# Altium schematic sheet VOLTAGE_RESOURCE.SchDoc: VOLTAGE_RESOURCE
size A4; Organization: My Company; Address1: Address Line 1; Address2: Address Line 2; Address3: Address Line 3; Address4: Address Line 4; SheetNumber: 2; SheetTotal: 4; ProjectTitle: Module_Ethernet_W5500
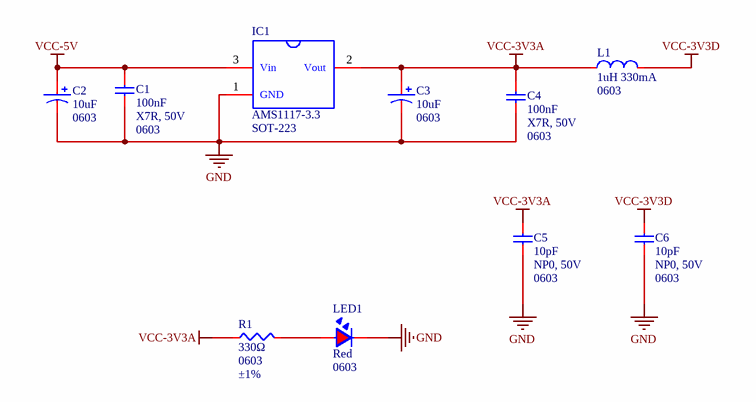
[diagram p0: VOLTAGE_RESOURCE.SchDoc]

## Parts
C1  100nF  Temperature Coefficient: X7R, 50V  Package: 0603  [C0603]
C2  10uF  Package: 0603  [C0603 - TANTA]
C3  10uF  Package: 0603  [C0603 - TANTA]
C4  100nF  Temperature Coefficient: X7R, 50V  Package: 0603  [C0603]
C5  10pF  Temperature Coefficient: NP0, 50V  Package: 0603  [C0603]
C6  10pF  Temperature Coefficient: NP0, 50V  Package: 0603  [C0603]
IC1  AMS1117-3.3  [SOT-223]
L1  1uH 330mA  Package: 0603  [L_0603]
LED1  Red  Package: 0603  [LED0603_RED]
R1  330Ω  Package: 0603  Tolerance: ±1%  [R0603]

## Nets
GND: C1.1 C2.2 C3.2 C4.1 C5.1 C6.1 IC1.1(GND) LED1.2
VCC-3V3A: C3.1 C4.2 C5.2 IC1.2(Vout) L1.1 R1.1
VCC-3V3D: C6.2 L1.2
VCC-5V: C1.2 C2.1 IC1.3(Vin)
NetLED1_1: LED1.1 R1.2

## Notes on the sheet
- Author:
- Title:
- Size:
- A4
- Project:
- Approved:
- Revision:
- Modified Date:
- CONFIDENTIAL
- Date:
- SW Version:

## Library data of the parts
C1 C4 = C0603_MLCC_100nF_X7R_50V: 50V 100nF X7R ±10% 0603 Multilayer Ceramic Capacitors MLCC - SMD/SMT ROHS; Manufacturer: YAGEO; Mfr. Part: CC0603KRX7R9BB104; LCSC Part: C14663; Capacitance: 100nF; Link: https://www.lcsc.com/product-detail/C14663.html; Tolerance: ±10%; Voltage Rating: 50V
C2 C3 = C0603_TANTA_10uF_6.3V: 10uF ±20% 6.3V Tantalum Capacitors 10Ω@100kHz 0603; Manufacturer: VISHAY; Mfr. Part: TMCJ0J106MTRF; Equivalent Series Resistance(ESR): 10H@100kHz; LCSC Part: C1953982; Capacitance: 10uF; Link: https://www.lcsc.com/product-detail/C1953982.html; Tolerance: ±20%; Voltage Rating: 6.3V; Operating Temperature: -55℃~+125℃
C5 C6 = C0603_MLCC_10pF_NP0_50V: 50V 10pF NP0 ±5% 0603 Multilayer Ceramic Capacitors MLCC - SMD/SMT ROHS; Manufacturer: YAGEO; Mfr. Part: CC0603JRNPO9BN100; LCSC Part: C106245; Capacitance: 10pF; Link: https://www.lcsc.com/product-detail/C106245.html; Tolerance: ±5%; Voltage Rating: 50V
IC1 = AMS1117-3.3_SOT-223: 72dB@(120Hz) 1A Fixed 3.3V Positive 16V SOT-223 Voltage Regulators - Linear, Low Drop Out (LDO) Regulators ROHS; Manufacturer: Advanced Monolithic Systems; Voltage Dropout: 1.1V@(800mA); Number of Outputs: 1; Mfr. Part: AMS1117-3.3; LCSC Part: C6186; Link: https://www.lcsc.com/product-detail/C6186.html?s_z=n_AMS1117-3.3; Category: Power Management (PMIC)/Voltage Regulators - Linear, Low Drop Out (LDO) Regulators; Output Current: 1A; Output Voltage: 3.3V; Output Configuration: Positive; Operating Temperature: -40℃~+125℃; Voltage - Supply: 16V; Package: SOT-223
L1 = L_1uH_0603_330mA: 330mA 1uH ±10% 810mΩ Wire-wound chip inductor 0603 Fixed Inductors RoHS; Manufacturer: APV; Manufacture Part Number: AHW1608F-1R0KTF; Link: https://www.lcsc.com/product-detail/C6364703.html; Inductor: 1uH; Current: 330mA; LCSC Part: C6364703
LED1 = LED0603_Red: 20mA 230mcd Water Clear -40℃~+85℃ 630nm Red 120° 75mW 1.95V 0603 LED Indication - Discrete ROHS; Manufacturer: Kingbright; Mfr. Part: APT1608SURCK; Key Attributes: 1.6 x 0.8 mm SMD Chip LED Lamp; LCSC Part: C5875723; Illumination Color: Red; Power(Watts): 75mW; Voltage - Forward(Vf): 1.95V; Forward Current: 20mA; Operating Temperature: -40℃~+85℃; Link: https://www.lcsc.com/product-detail/C5875723.html
R1 = R0603_330Ω_±1%: 100mW Thick Film Resistor 75V ±100ppm/℃ ±1% 330Ω 0603 Chip Resistor - Surface Mount ROHS; Manufacturer: YAGEO; Mfr. Part: RC0603FR-07330RL; LCSC Part: C105881; Resistance: 330Ω; Operating Temperature: -55℃~+155℃; Link: https://www.lcsc.com/product-detail/C105881.html